# Altium schematic sheet transmeter.SchDoc
size OrCAD C; SheetNumber: 2; SheetTotal: 2
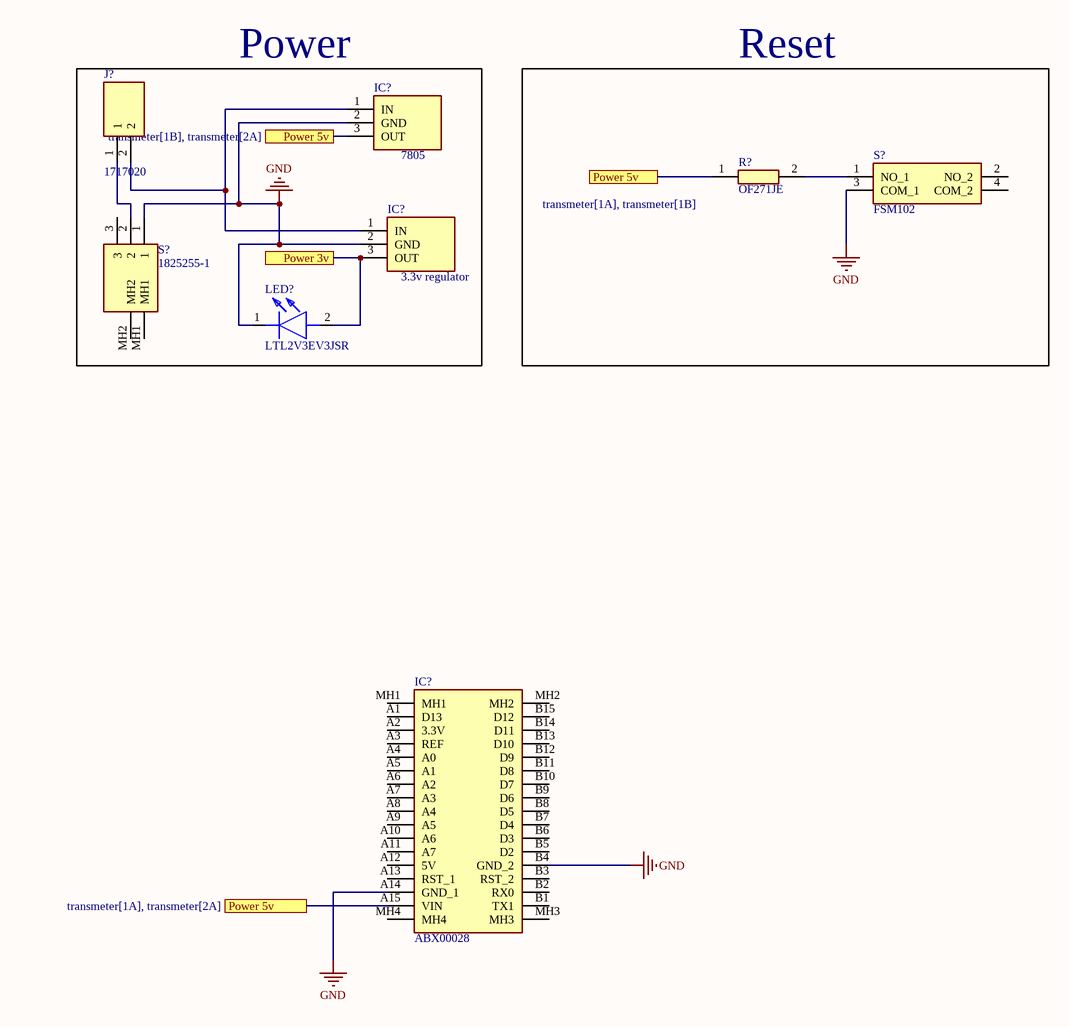
[diagram p0: transmeter.SchDoc]

## Parts
(Parts that share a designator on the sheet are numbered #1, #2 ... from top to bottom, then left to right.)
IC?#1  7805  [TO254P470X1000X1610-3P]
IC?#2  3.3v regulator  [TO254P470X1000X1610-3P]
IC?#3  ABX00028  [ABX00028]
J?  1717020  [1717020]
LED?  LTL2V3EV3JSR  [LTL2V3EV3JSR]
R?  OF271JE  [RESAD2550W70L1030D380]
S?#1  FSM102  [FSM102]
S?#2  1825255-1  [18252551]

## Blocks framed on the sheet
Power: IC?#1 IC?#2 J? LED? S?#2
Reset: R? S?#1

## Ports
Power 3v, Power 5v (see transmeter[1A], transmeter[1B]), Power 5v (see transmeter[1A], transmeter[2A]), Power 5v (see transmeter[1B], transmeter[2A])

## Nets
GND: IC?#1.2(GND) IC?#2.2(GND) IC?#3.A14(GND_1) IC?#3.B4(GND_2) LED?.1(K) S?#1.3(COM_1) S?#2.1
Power 3v: IC?#2.3(OUT) LED?.2(A) ; port Power 3v
Power 5v: IC?#1.3(OUT) IC?#3.A15(VIN) R?.1 ; port Power 5v
NetIC?#1_1: IC?#1.1(IN) IC?#2.1(IN) J?.2
NetJ?_1: J?.1 S?#2.2
NetR?_2: R?.2 S?#1.1(NO_1)

Not connected (* = marked no-connect by the designer): IC?#3 A1(D13) A2(3.3V) A3(REF) A4(A0) A5(A1) A6(A2) A7(A3) A8(A4) A9(A5) A10(A6) A11(A7) A12(5V) A13(RST_1) B1(TX1) B2(RX0) B3(RST_2) B5(D2) B6(D3) B7(D4) B8(D5) B9(D6) B10(D7) B11(D8) B12(D9) B13(D10) B14(D11) B15(D12) MH1 MH2 MH3 MH4; S?#1 2(NO_2) 4(COM_2); S?#2 3 MH1 MH2

## Library data of the parts
IC?#1 IC?#2 = 7805: Integrated Circuit; Manufacturer_Name: Foshan Blue Rocket Elec; Datasheet Link: https://datasheet.lcsc.com/szlcsc/1812061730_BLUE-ROCKET-7805_C305416.pdf; Height: 4.7mm; Manufacturer_Part_Number: 7805
IC?#3 = ABX00028: Integrated Circuit; Manufacturer_Name: Arduino; Datasheet Link: https://store.arduino.cc/arduino-nano-every; Height: 10mm; Manufacturer_Part_Number: ABX00028; Mouser Part Number: 782-ABX00028; Mouser Price/Stock: https://www.mouser.co.uk/ProductDetail/Arduino/ABX00028?qs=PzGy0jfpSMtit6rnFl8mVg%3D%3D; Arrow Part Number: ABX00028; Arrow Price/Stock: https://www.arrow.com/en/products/abx00028/arduino-corporation?region=nac
J? = 1717020: Connector; Manufacturer_Name: Phoenix Contact; Datasheet Link: https://www.phoenixcontact.com/en-us/products/printed-circuit-board-terminal-gmkds-15-2-1717020; Manufacturer_Part_Number: 1717020; Mouser Part Number: 651-1717020; Mouser Price/Stock: https://www.mouser.co.uk/ProductDetail/Phoenix-Contact/1717020?qs=aYsvlkyO7qPz8sNM1KmjVQ%3D%3D; Arrow Part Number: 1717020; Arrow Price/Stock: https://www.arrow.com/en/products/1717020/phoenix-contact
LED? = LTL2V3EV3JSR: LED; Manufacturer_Name: Lite-On; Datasheet Link: https://componentsearchengine.com/Datasheets/1/LTL2V3EV3JSR.pdf; Height: 12.7mm; Manufacturer_Part_Number: LTL2V3EV3JSR; Mouser Part Number: 859-LTL2V3EV3JSR; Mouser Price/Stock: https://www.mouser.co.uk/ProductDetail/Lite-On/LTL2V3EV3JSR?qs=plZGoh4IuyGDOWbhxHlEvg%3D%3D; Arrow Part Number: LTL2V3EV3JSR; Arrow Price/Stock: https://www.arrow.com/en/products/ltl2v3ev3jsr/lite-on-technology
R? = OF271JE: Resistor; Manufacturer_Name: Ohmite; Datasheet Link: http://www.ohmite.com/catalog/od-of-oa-series/OF271JE; Manufacturer_Part_Number: OF271JE; Mouser Part Number: 588-OF271JE; Mouser Price/Stock: https://www.mouser.co.uk/ProductDetail/Ohmite/OF271JE?qs=Nw8JbBc1V0%252BxO2tZrSOeuA%3D%3D
S?#1 = FSM102: Switch; Manufacturer_Name: TE Connectivity; Datasheet Link: https://componentsearchengine.com/Datasheets/1/FSM102.pdf; Height: 12.3mm; Manufacturer_Part_Number: FSM102; Mouser Part Number: 506-FSM102; Mouser Price/Stock: https://www.mouser.co.uk/ProductDetail/TE-Connectivity-Alcoswitch/FSM102?qs=%2F%2Fg65P91twP4ZFN%252BC7xbXQ%3D%3D; Arrow Part Number: FSM102; Arrow Price/Stock: https://www.arrow.com/en/products/fsm102/te-connectivity?region=nac
S?#2 = 1825255-1: Switch; Manufacturer_Name: TE Connectivity; Datasheet Link: https://www.te.com/commerce/DocumentDelivery/DDEController?Action=srchrtrv&DocNm=1825255&DocType=Customer+Drawing&DocLang=English; Height: 12.3mm; Manufacturer_Part_Number: 1825255-1; Arrow Part Number: 1825255-1; Arrow Price/Stock: https://www.arrow.com/en/products/1825255-1/te-connectivity